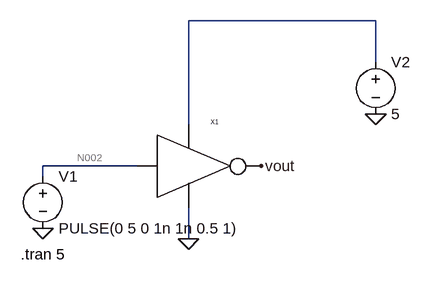
[diagram p0: schematic inverterouput.asc]
inverterouput.asc, the LTspice schematic file:
Version 4
SHEET 1 880 680
WIRE 464 -64 176 -64
WIRE 464 0 464 -64
WIRE 176 96 176 -64
WIRE 96 160 -48 160
WIRE -48 176 -48 160
WIRE 176 272 176 224
FLAG 176 272 0
FLAG 464 80 0
FLAG -48 256 0
FLAG 288 160 vout
SYMBOL inverter 176 160 R0
SYMATTR InstName X1
SYMBOL voltage -48 160 R0
WINDOW 123 0 0 Left 0
WINDOW 39 0 0 Left 0
SYMATTR InstName V1
SYMATTR Value PULSE(0 5 0 1n 1n 0.5 1)
SYMBOL voltage 464 -16 R0
WINDOW 123 0 0 Left 0
WINDOW 39 0 0 Left 0
SYMATTR InstName V2
SYMATTR Value 5
TEXT -82 296 Left 2 !.tran 5

The netlist it stands for:
* inverterouput.asc
XX1 N002 N001 0 vout inverter  ; pins vin vdd vg vout
V1 N002 0 PULSE(0 5 0 1n 1n 0.5 1)
V2 N001 0 5
.tran 5
.backanno
.end

* Results of the author's LTspice run, read from the files saved beside the schematic
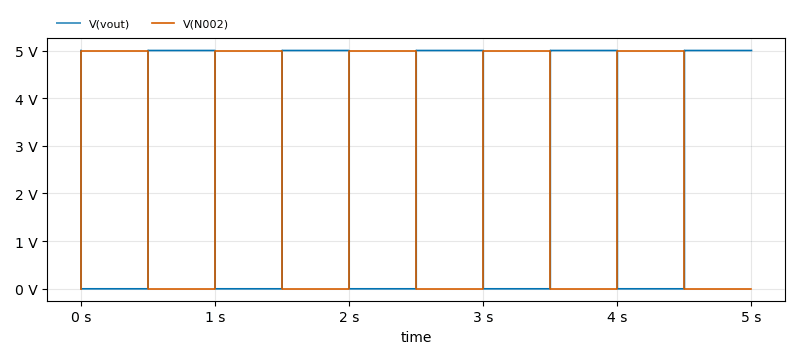
[diagram p1: Transient Analysis of inverterouput.asc, plotted from the saved traces]
* Transient Analysis, 1 run:
*   V(vout): min -732.3 nV, max 5.003 V, average 2.5 V, rms 3.536 V, last 5 V
*   V(N002): min 0 V, max 5 V, average 2.5 V, rms 3.536 V, last 0 V